# EAGLE design esp32_relay (EAGLE 7.4.0)
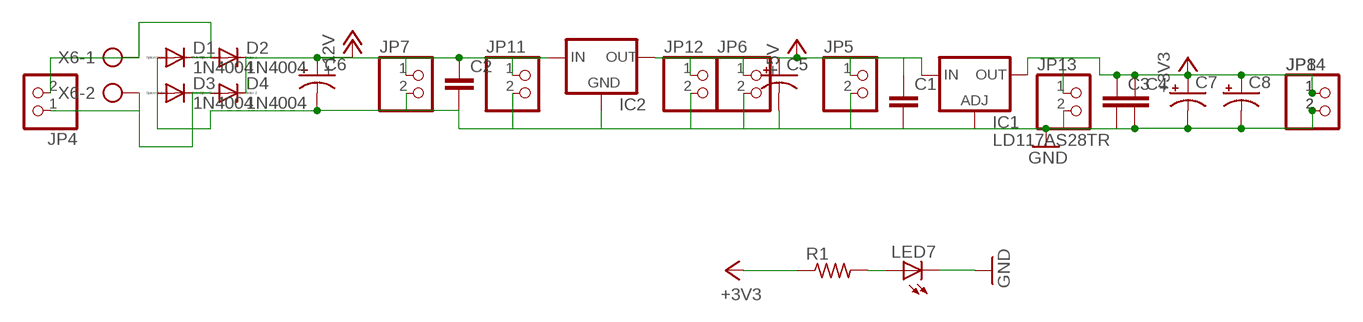
[diagram p0: schematic, sheet 1, part 1 of 2]
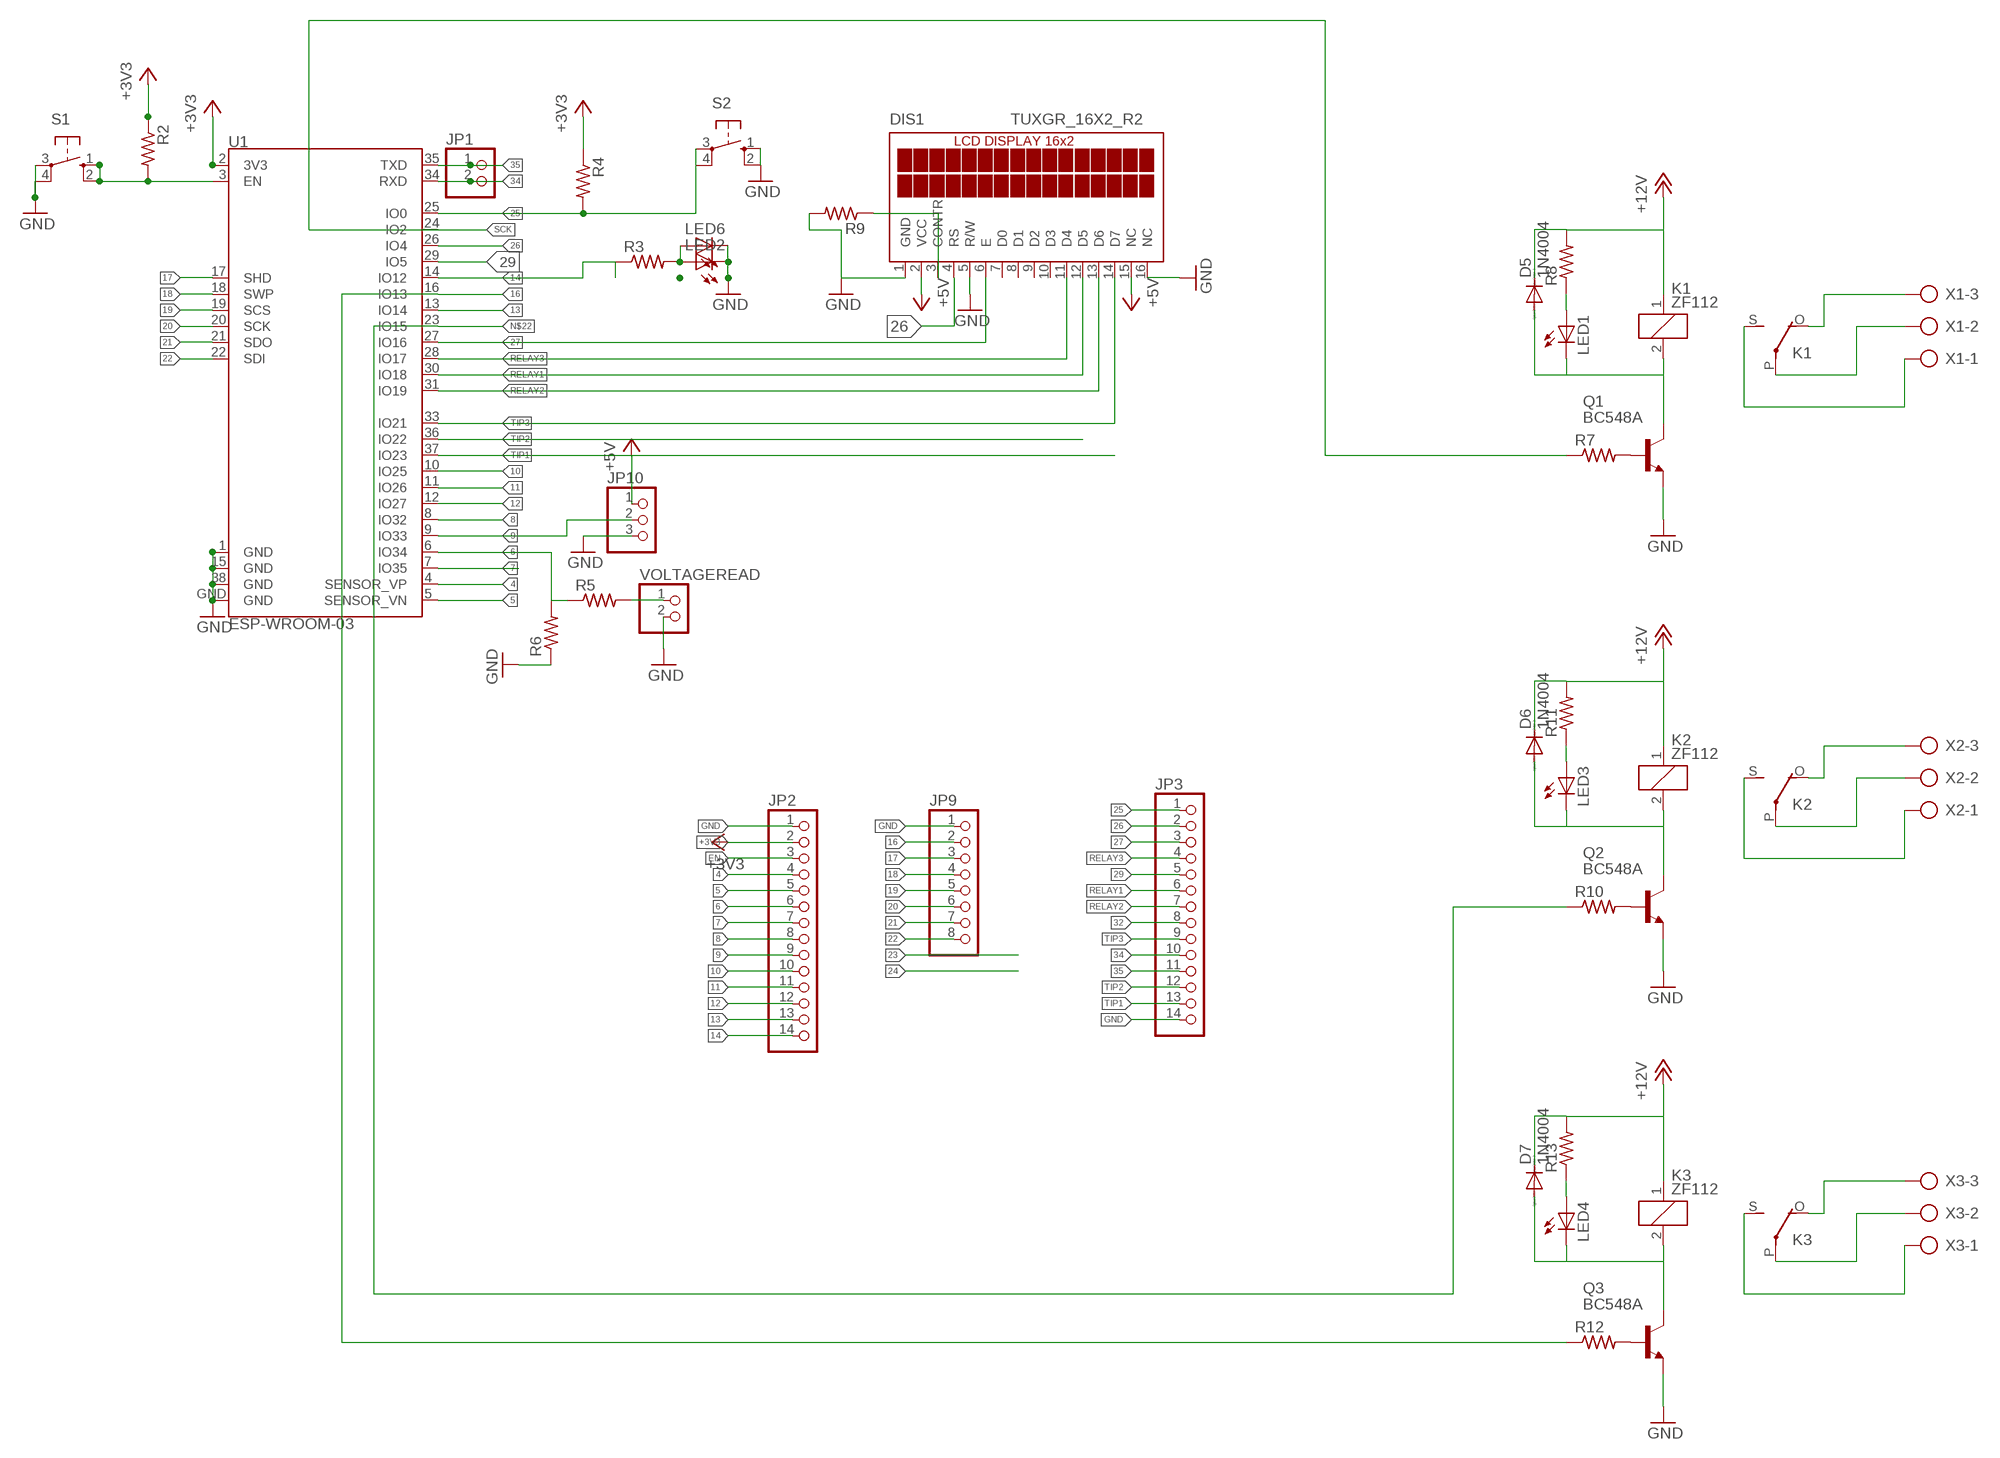
[diagram p1: schematic, sheet 1, part 2 of 2]

## Parts
C1  C-EUC1206  [C1206]
C2  C-EUC1206  [C1206]
C3  C-EUC1206  [C1206]
C4  C-EUC1206  [C1206]
C5  CPOL-USE2.5-7  [E2,5-7]
C6  CPOL-USE2.5-7  [E2,5-7]
C7  CPOL-USE2.5-6  [E2,5-6]
C8  CPOL-USE2.5-7  [E2,5-7]
D1  1N4004  [DO41-10]
D2  1N4004  [DO41-10]
D3  1N4004  [DO41-10]
D4  1N4004  [DO41-10]
D5  1N4004  [DO41-10]
D6  1N4004  [DO41-10]
D7  1N4004  [DO41-10]
DIS1  TUXGR_16X2_R2  [TUXGR_16X2_R2]
IC1  LD117AS28TR  [SOT223]
IC2  78XXL  [78XXL]
JP1  PINHD-1X2  [1X02]
JP2  PINHD-1X14  [1X14]
JP3  PINHD-1X14  [1X14]
JP4  PINHD-1X2  [1X02]
JP5  PINHD-1X2  [1X02]
JP6  PINHD-1X2  [1X02]
JP7  PINHD-1X2  [1X02]
JP8  PINHD-1X2  [1X02]
JP9  PINHD-1X8  [1X08]
JP10  PINHD-1X3  [1X03]
JP11  PINHD-1X2  [1X02]
JP12  PINHD-1X2  [1X02]
JP13  PINHD-1X2  [1X02]
JP14  PINHD-1X2  [1X02]
K1  ZF112  [ZF112]
K2  ZF112  [ZF112]
K3  ZF112  [ZF112]
LED1  LED3MM  [LED3MM]
LED2  LEDCHIPLED_1206  [CHIPLED_1206]
LED3  LED3MM  [LED3MM]
LED4  LED3MM  [LED3MM]
LED6  LED3MM  [LED3MM]
LED7  LED3MM  [LED3MM]
Q1  BC548A  [TO92-EBC]
Q2  BC548A  [TO92-EBC]
Q3  BC548A  [TO92-EBC]
R1  R-US_0207/7  [0207/7]
R2  R-US_0207/7  [0207/7]
R3  R-US_0207/7  [0207/7]
R4  R-US_0207/7  [0207/7]
R5  R-US_0207/7  [0207/7]
R6  R-US_0207/7  [0207/7]
R7  R-US_0207/7  [0207/7]
R8  R-US_0207/7  [0207/7]
R9  R-US_0207/7  [0207/7]
R10  R-US_0207/7  [0207/7]
R11  R-US_0207/7  [0207/7]
R12  R-US_0207/10  [0207/10]
R13  R-US_0207/7  [0207/7]
S1  10-XX  [B3F-10XX]
S2  10-XX  [B3F-10XX]
U1  ESP-WROOM-03  [ESP-WROOM-03]
VOLTAGEREAD  PINHD-1X2  [1X02]
X1  AK500/3-H  [AK500/3-H]
X2  AK500/3-H  [AK500/3-H]
X3  AK500/3-H  [AK500/3-H]
X6  AK500/2-H  [AK500/2-H]

## Nets
4: JP2.4 U1.4(SENSOR_VP)
5: JP2.5 U1.5(SENSOR_VN)
6: JP2.6 R5.1 R6.2 U1.6(IO34)
7: JP2.7 U1.7(IO35)
8: JP2.8 U1.8(IO32)
9: JP2.9 JP10.2 U1.9(IO33)
10: JP2.10 U1.10(IO25)
11: JP2.11 U1.11(IO26)
12: JP2.12 U1.12(IO27)
13: JP2.13 U1.13(IO14)
14: JP2.14 R3.1 U1.14(IO12)
16: JP9.2 R12.1 U1.16(IO13)
17: JP9.3 U1.17(SHD)
18: JP9.4 U1.18(SWP)
19: JP9.5 U1.19(SCS)
20: JP9.6 U1.20(SCK)
21: JP9.7 U1.21(SDO)
22: JP9.8 U1.22(SDI)
25: JP3.1 R4.2 S2.3(P) S2.4(P1) U1.25(IO0)
26: DIS1.4(RS) JP3.2 U1.26(IO4)
27: DIS1.6(E) JP3.3 U1.27(IO16)
29: JP3.5 U1.29(IO5)
32: JP3.8
34: JP1.2 JP3.10 U1.34(RXD)
35: JP1.1 JP3.11 U1.35(TXD)
+3V3: C3.1 C4.1 C7.+ C8.+ IC1.4(OUT) JP2.2 JP8.1 JP13.1 JP14.1 R1.1 R2.1 R4.1 U1.2(3V3)
+5V: C1.1 C5.+ DIS1.2(VCC) DIS1.15(NC) IC1.3(IN) IC2.OUT JP5.1 JP6.1 JP10.1 JP12.1
+12V: C2.1 C6.+ D2.C D4.C D5.C D6.C D7.C IC2.IN JP7.1 JP11.1 K1.1 K2.1 K3.1 R8.2 R11.2 R13.2
EN: JP2.3 R2.2 S1.1(S) S1.2(S1) U1.3(EN)
GND: C1.2 C2.2 C3.2 C4.2 C5.- C6.- C7.- C8.- D1.A D3.A DIS1.1(GND) DIS1.5(R/W) DIS1.16(NC) IC1.1(ADJ) IC2.GND JP2.1 JP3.14 JP5.2 JP6.2 JP7.2 JP8.2 JP9.1 JP10.3 JP11.2 JP12.2 JP13.2 JP14.2 LED2.C LED6.K(C) LED7.K(C) Q1.E Q2.E Q3.E R6.1 R9.2 S1.3(P) S1.4(P1) S2.1(S) S2.2(S1) U1.1(GND) U1.15(GND) U1.38(GND) U1.GND VOLTAGEREAD.2
N$3: LED7.A R1.2
N$5: D3.C D4.A JP4.1 X6.2
N$6: Q1.B R7.2
N$7: R5.2 VOLTAGEREAD.1
N$8: D5.A K1.2 LED1.K(C) Q1.C
N$9: K1.P(2:P) X1.2
N$10: LED2.A LED6.A R3.2
N$11: K1.O(2:O) X1.3
N$12: D1.C D2.A JP4.2 X6.1
N$13: K1.S(2:S) X1.1
N$14: LED1.A R8.1
N$16: DIS1.3(CONTR) R9.1
N$22: R10.1 U1.23(IO15)
N$24: Q2.B R10.2
N$25: D6.A K2.2 LED3.K(C) Q2.C
N$26: K2.P(2:P) X2.2
N$27: K2.O(2:O) X2.3
N$28: K2.S(2:S) X2.1
N$29: LED3.A R11.1
N$30: Q3.B R12.2
N$31: D7.A K3.2 LED4.K(C) Q3.C
N$32: K3.P(2:P) X3.2
N$33: K3.O(2:O) X3.3
N$34: K3.S(2:S) X3.1
N$35: LED4.A R13.1
RELAY1: DIS1.12(D5) JP3.6 U1.30(IO18)
RELAY2: DIS1.13(D6) JP3.7 U1.31(IO19)
RELAY3: DIS1.11(D4) JP3.4 U1.28(IO17)
SCK: R7.1 U1.24(IO2)
TIP1: JP3.13 U1.37(IO23)
TIP2: JP3.12 U1.36(IO22)
TIP3: DIS1.14(D7) JP3.9 U1.33(IO21)
Unconnected: DIS1.7(D0) DIS1.8(D1) DIS1.9(D2) DIS1.10(D3)

## Library data of the parts
C1-C4 = rcl:C-EU: CAPACITOR, European symbol
C5-C8 = rcl:CPOL-US: POLARIZED CAPACITOR, American symbol
D1-D7 = diode:1N4004: DIODE general purpose rectifier, 1 A
DIS1 = display-lcd:TUXGR_16X2_R2: Tuxgraphics LCD display 16x2 characters reflective, without background light Source: tuxgr_12x2_r2.pdf; OC_FARNELL: unknown; OC_NEWARK: unknown
IC1 = v-reg:LD117A?*: Low drop fixed and adjustable positive voltage regulators 1 A Source: http://www.st.com/stonline/products/literature/ds/7194/ld1117axx.pdf
IC2 = v-reg:78XXL: VOLTAGE REGULATOR
JP1 JP4-JP8 JP11-JP14 VOLTAGEREAD = pinhead:PINHD-1X2: PIN HEADER
JP2 JP3 = pinhead:PINHD-1X14: PIN HEADER
JP9 = pinhead:PINHD-1X8: PIN HEADER
JP10 = pinhead:PINHD-1X3: PIN HEADER
K1-K3 = relay:ZF112: RELAY 1 x switch; OC_FARNELL: unknown; OC_NEWARK: unknown
LED1-LED4 LED6 LED7 = led:LED: LED OSRAM: - CHIPLED LG R971, LG N971, LY N971, LG Q971, LY Q971, LO R971, LY R971 LH N974, LH R974 LS Q976, LO Q976, LY Q976 LO Q996 - Hyper CHIPLED LW Q18S LB Q993, LB Q99A, LB R99A - SideLED LS A670, LO A670, LY A670, LG A670, LP A670 LB A673, LV A673, LT A673, LW A673 LH A674 LY A675 LS A676, LA A676, LO A676, LY A676, LW A676 LS A679, LY A679, LG A679 - Hyper Micro SIDELED® LS Y876, LA Y876, LO Y876, LY Y876 LT Y87S - SmartLED LW L88C, LW L88S LB L89C, LB L89S, LG L890 LS L89K, LO L89K, LY L89K LS L896, LA L896, LO L896, LY L896 - TOPLED LS T670, LO T670, LY T670, LG T670, LP T670 LSG T670, LSP T670, LSY T670, LOP T670, LYG T670 LG T671, LOG T671, LSG T671 LB T673, LV T673, LT T673, LW T673 LH T674 LS T676, LA T676, LO T676, LY T676, LB T676, LH T676, LSB T676, LW T676 LB T67C, LV T67C, LT T67C, LS T67K, LO T67K, LY T67K, LW E67C LS E67B, LA E67B, LO E67B, LY E67B, LB E67C, LV E67C, LT E67C LW T67C LS T679, LY T679, LG T679 LS T770, LO T770, LY T770, LG T770, LP T770 LB T773, LV T773, LT T773, LW T773 LH T774 LS E675, LA E675, LY E675, LS T675 LS T776, LA T776, LO T776, LY T776, LB T776 LHGB T686 LT T68C, LB T68C - Hyper Mini TOPLED® LB M676 - Mini TOPLED Santana® LG M470 LS M47K, LO M47K, LY M47K Source: http://www.osram.convergy.de LUXEON: - LUMILED® LXK2-PW12-R00, LXK2-PW12-S00, LXK2-PW14-U00, LXK2-PW14-V00 LXK2-PM12-R00, LXK2-PM12-S00, LXK2-PM14-U00 LXK2-PE12-Q00, LXK2-PE12-R00, LXK2-PE12-S00, LXK2-PE14-T00, LXK2-PE14-U00 LXK2-PB12-K00, LXK2-PB12-L00, LXK2-PB12-M00, LXK2-PB14-N00, LXK2-PB14-P00, LXK2-PB14-Q00 LXK2-PR12-L00, LXK2-PR12-M00, LXK2-PR14-Q00, LXK2-PR14-R00 LXK2-PD12-Q00, LXK2-PD12-R00, LXK2-PD12-S00 LXK2-PH12-R00, LXK2-PH12-S00 LXK2-PL12-P00, LXK2-PL12-Q00, LXK2-PL12-R00 Source: www.luxeon.com KINGBRIGHT: KA-3528ASYC Source: www.kingbright.com
Q1-Q3 = transistor-npn:BC548*: NPN Transistor
R1-R13 = rcl:R-US_: RESISTOR, American symbol
S1 S2 = switch-omron:10-XX: OMRON SWITCH; MPN: B3F-1000; OC_FARNELL: 176432; OC_NEWARK: 36M3542
U1 = esp32:ESP-WROOM-03
X1-X3 = con-ptr500:AK500/3-H: CONNECTOR Aug. 2004 / PTR Meßtechnik: Die Bezeichnung der Serie AK505 wurde geändert. Es handelt sich hierbei um AK500 in horizontaler Ausführung.; OC_FARNELL: unknown; OC_NEWARK: unknown
X6 = con-ptr500:AK500/2-H: CONNECTOR Aug. 2004 / PTR Meßtechnik: Die Bezeichnung der Serie AK505 wurde geändert. Es handelt sich hierbei um AK500 in horizontaler Ausführung.; OC_FARNELL: unknown; OC_NEWARK: unknown

## Board
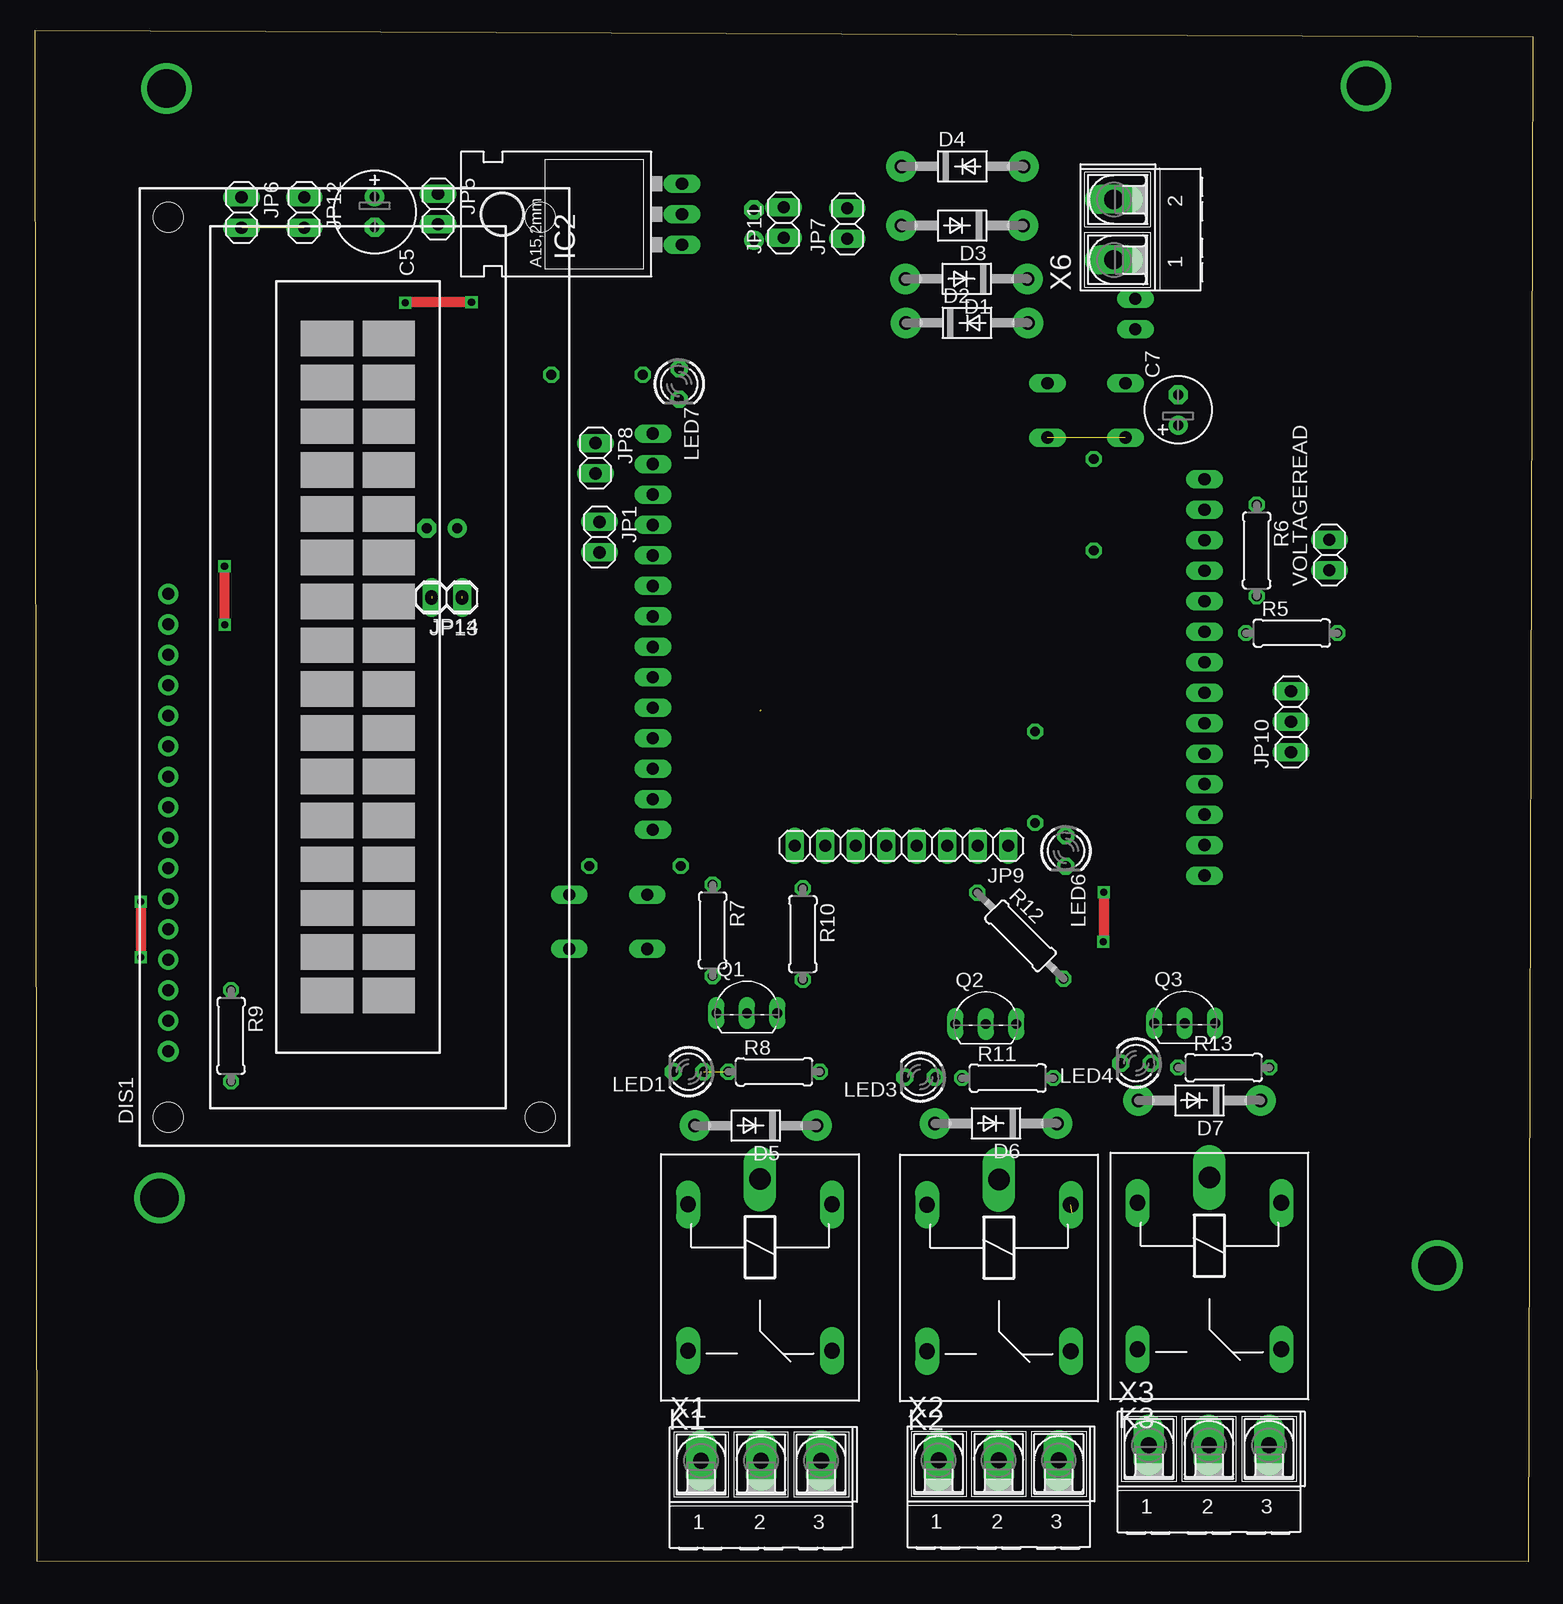
[diagram p2: board, top side]
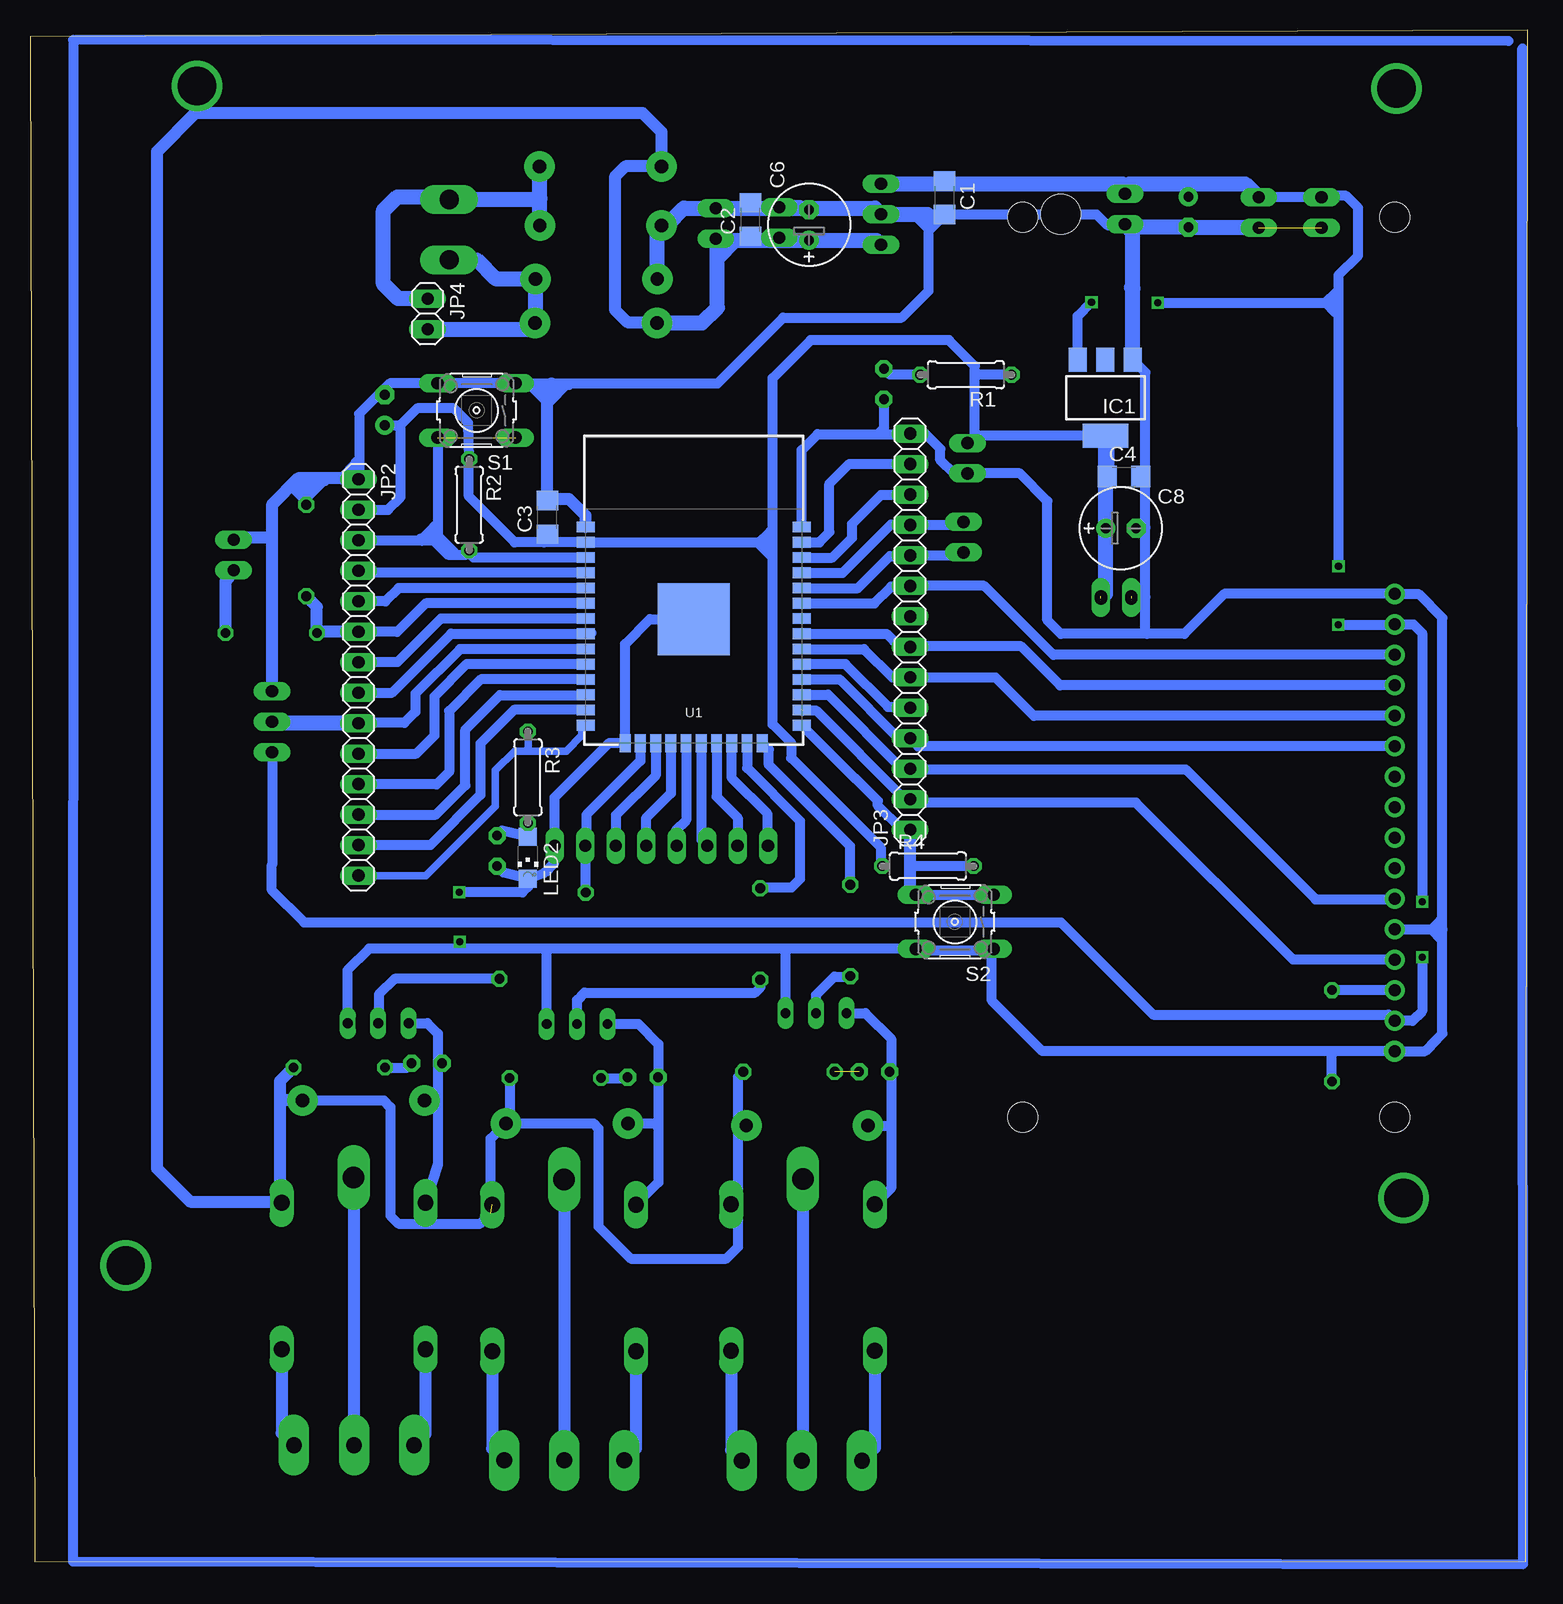
[diagram p3: board, bottom side, seen from below]

Size 124.82 x 127.66 mm. Coordinates in mm from the lower left corner, seen from the top.
Outline: 124.43,0 0.18,0.08 0,127.66 124.82,127.09 124.43,0
Copper layers (1*16): Top 0.035mm / dielectric 1.5mm / Bottom 0.035mm
Design rules "default": minimum track width 10mil, minimum drill 24mil, track to track 8mil, track to pad 8mil, pad to pad 8mil, via to via 8mil, smd to smd 8mil, copper to edge 40mil, drill to drill 8mil, minimum pad ring 10mil, minimum via ring 8mil, stop-mask expansion 4mil, vias tented up to drill 0mil, thermal gap 10mil
bRestrict: area 60.2,87.7 to 78.8,94

### Footprints (pad centres in the part's own frame; a part is rotated, then mirrored left to right if it is on the bottom)
C1206 = smd 1.6 x 1.8: 1 -1.4,0; 2 1.4,0
E2,5-7 = drill 0.813 pad 1.6: + -1.27,0 | drill 0.813 pad 1.6 octagon: - 1.27,0
E2,5-6 = drill 0.813 pad 1.6: + -1.27,0 | drill 0.813 pad 1.6 octagon: - 1.27,0
DO41-10 = drill 1.118 pad 2.54: A 5.08,0; C -5.08,0
TUXGR_16X2_R2 = drill 1 pad 1.778: 1 -32,15.5 | drill 1 pad 1.676: 2 -29.46,15.5; 3 -26.92,15.5; 4 -24.38,15.5; 5 -21.84,15.5; 6 -19.3,15.5; 7 -16.76,15.5; 8 -14.22,15.5; 9 -11.68,15.5; 10 -9.14,15.5; 11 -6.6,15.5; 12 -4.06,15.5; 13 -1.52,15.5; 14 1.02,15.5; 15 3.56,15.5; 16 6.1,15.5 | hole 2.5: -37.5,-15.5; 37.5,-15.5; -37.5,15.5; 37.5,15.5
SOT223 = smd 1.5 x 2: 1 -2.3,-3.15; 2 0,-3.15; 3 2.3,-3.15 | smd 3.8 x 2: 4 0,3.15
78XXL = drill 1.016 long: GND 0,-3.81; IN -2.54,-3.81; OUT 2.54,-3.81 | hole 3.302: 0,11.176
1X02 = drill 1.016 long: 1 -1.27,0; 2 1.27,0
1X14 = drill 1.016 long: 1 -16.51,0; 2 -13.97,0; 3 -11.43,0; 4 -8.89,0; 5 -6.35,0; 6 -3.81,0; 7 -1.27,0; 8 1.27,0; 9 3.81,0; 10 6.35,0; 11 8.89,0; 12 11.43,0; 13 13.97,0; 14 16.51,0
1X08 = drill 1.016 long: 1 -8.89,0; 2 -6.35,0; 3 -3.81,0; 4 -1.27,0; 5 1.27,0; 6 3.81,0; 7 6.35,0; 8 8.89,0
1X03 = drill 1.016 long: 1 -2.54,0; 2 0,0; 3 2.54,0
ZF112 = drill 1.321 long: 1 -6.096,5.994; 2 -6.096,-5.994; O 6.096,5.994; S 6.096,-5.994 | drill 1.803 long: P -8.204,0
LED3MM = drill 0.813 pad 1.422 octagon: A -1.27,0; K 1.27,0
CHIPLED_1206 = smd 1.5 x 1.5: A 0,-1.75; C 0,1.75
TO92-EBC = drill 0.813 long: B 0,-1.27; C -2.54,-1.27; E 2.54,-1.27
0207/7 = drill 0.813 octagon: 1 -3.81,0; 2 3.81,0
0207/10 = drill 0.813 octagon: 1 -5.08,0; 2 5.08,0
B3F-10XX = drill 1.016 long: 1 -3.251,2.261; 2 3.251,2.261; 3 -3.251,-2.261; 4 3.251,-2.261
ESP-WROOM-03 = smd 0.9 x 1.5: 1 7.7,9; 2 6.43,9; 3 5.16,9; 4 3.89,9; 5 2.62,9; 6 1.35,9; 7 0.08,9; 8 -1.19,9; 9 -2.46,9; 10 -3.73,9; 11 -5,9; 12 -6.27,9; 13 -7.54,9; 14 -8.81,9; 25 -8.81,-9; 26 -7.54,-9; 27 -6.27,-9; 28 -5,-9; 29 -3.73,-9; 30 -2.46,-9; 31 -1.19,-9; 32 0.08,-9; 33 1.35,-9; 34 2.62,-9; 35 3.89,-9; 36 5.16,-9; 37 6.43,-9; 38 7.7,-9 | smd 1.5 x 0.9: 15 -10.3,5.715; 16 -10.3,4.445; 17 -10.3,3.175; 18 -10.3,1.905; 19 -10.3,0.635; 20 -10.3,-0.635; 21 -10.3,-1.905; 22 -10.3,-3.175; 23 -10.3,-4.445; 24 -10.3,-5.715 | smd 6 x 6: GND 0,0
AK500/3-H = drill 1.321 pad 2.54 long: 1 -5.004,0; 2 0,0; 3 5.004,0
AK500/2-H = drill 1.6 long: 1 -2.515,0; 2 2.515,0

### Placement (x,y rotation side)
C1  48.62,113.68 270 bottom
C2  64.78,111.87 90 bottom
C3  81.7,87.05 90 bottom
C4  33.65,90.44 0 bottom
C5  28.29,112.5 270 top
C6  59.9,111.42 90 bottom
C7  95.26,96 90 top
C8  33.91,86.14 0 bottom
D1  77.63,106.92 180 top
D2  77.67,103.25 0 top
D3  77.26,111.37 180 top
D4  77.27,116.29 0 top
D5  60.05,36.36 180 top
D6  80.08,36.54 180 top
D7  97.03,38.46 180 top
DIS1  26.6,74.56 90 top
IC1  35.21,97.02 180 bottom
IC2  50.09,112.31 90 top
JP1  47.03,85.39 270 top
JP2  97.45,73.71 270 bottom
JP3  51.48,77.52 90 bottom
JP4  91.69,104 270 bottom
JP5  33.57,112.74 270 top
JP6  17.2,112.45 270 top
JP7  67.68,111.53 90 top
JP8  46.7,91.97 270 top
JP9  72.2,59.68 180 top
JP10  104.65,70.02 90 top
JP11  62.38,111.61 90 top
JP12  22.42,112.45 270 top
JP13  34.31,80.29 180 top
JP14  34.31,80.45 180 top
K1  60.41,23.7 270 top
K2  80.32,23.66 270 top
K3  97.86,23.83 270 top
LED1  54.46,40.84 180 top
LED2  83.33,58.7 180 bottom
LED3  73.75,40.4 180 top
LED4  91.75,41.55 180 top
LED6  85.9,59.26 270 top
LED7  53.66,98.16 270 top
Q1  59.31,47 0 top
Q2  79.23,46.1 0 top
Q3  95.8,46.16 0 top
R1  46.83,98.93 180 bottom
R2  88.22,88.1 270 bottom
R3  83.33,65.39 270 bottom
R4  49.99,57.99 0 bottom
R5  104.72,77.41 0 top
R6  101.8,84.29 270 top
R7  56.46,52.63 270 top
R8  61.57,40.84 0 top
R9  16.32,43.84 270 top
R10  63.98,52.32 270 top
R11  81.04,40.32 0 top
R12  82.11,52.18 315 top
R13  99.05,41.2 0 top
S1  87.61,95.96 180 bottom
S2  47.76,53.34 180 bottom
U1  69.51,78.54 90 bottom
VOLTAGEREAD  107.85,83.92 90 top
X1  60.5,8.43 0 top
X2  80.29,8.47 0 top
X3  97.82,9.73 0 top
X6  89.9,111.02 90 top

### Tracks (layer width: path | path; a pad name or v marks a point on that pad's centre or on a via)
4
  Bottom 0.813: U1.4 97.28,82.43 JP2.4
5
  Bottom 0.813: U1.5 94.1,81.16 95.2,80.05 97.44,80.05 JP2.5
6
  Bottom 0.813: U1.6 91.85,79.89 94.23,77.51 97.44,77.51 JP2.6
  Bottom 1.016: JP2.6 100.79,77.52 R5.1 100.91,79.59 R6.2
7
  Bottom 0.813: U1.7 90.58,78.62 94.2,74.99 97.44,74.99 JP2.7
8
  Bottom 0.813: JP2.8 94.65,72.44 89.73,77.36 78.31,77.36 | 78.31,77.36 78.07,77.36 78.01,77.42 | U1.8 78.32,77.35 78.31,77.36
9
  Bottom 0.813: U1.9 88.98,76.08 92.7,72.35 92.7,70.84 93.62,69.93 97.43,69.93 JP2.9
  Bottom 1.27: JP2.9 104.54,69.9 JP10.2
10
  Bottom 0.813: JP2.10 92.63,67.36 91.1,68.89 91.1,72.14 88.41,74.83 78.53,74.83 U1.10
11
  Bottom 0.813: U1.11 87.25,73.54 89.9,70.89 89.9,65.84 90.94,64.8 97.43,64.8 JP2.11
12
  Bottom 0.813: JP2.12 90.99,62.28 88.55,64.72 88.55,69.36 85.67,72.24 78.54,72.24 U1.12
13
  Bottom 0.813: U1.13 84.48,71 87.28,68.2 87.28,63.92 91.46,59.74 JP2.13
14
  Bottom 0.61: JP2.14 91.83,57.2 86.04,62.99 86.04,65.96 84.42,67.58 83.57,67.58 | 83.57,67.58 83.3,67.58 | 83.3,67.58 80.13,67.58 78.82,68.89 78.82,69.42 U1.14 | 83.53,67.62 83.57,67.58 | R3.1 83.3,69.2 83.3,67.58
16
  Bottom 0.813: U1.16 73.96,66.75 78.45,62.26 78.45,60.48 78.63,60.3 78.63,59.75 JP9.2 78.55,55.81 R12.1
17
  Bottom 0.813: U1.17 72.69,65.53 75.99,62.23 75.99,59.7 JP9.3
18
  Bottom 0.813: U1.18 71.42,64.05 73.5,61.96 73.5,59.7 JP9.4
19
  Bottom 0.813: U1.19 70.15,61.82 71,60.97 71,59.74 JP9.5
20
  Bottom 0.813: U1.20 68.88,60.16 JP9.6
21
  Bottom 0.813: U1.21 67.61,63.77 65.84,62 65.84,59.69 JP9.7
22
  Bottom 0.813: JP9.8 63.4,59.77 63.4,62.38 66.34,65.32 U1.22
  Bottom 1.016: 63.3,59.66 JP9.8
25
  Bottom 0.813: S2.4 S2.3 | U1.25 56.09,65.3 56.05,65.3 54.17,63.42 54.17,63.03 52.19,61.05 51.52,61.05 JP3.1 | R4.2 51.48,57.99 51.48,58.14
  Bottom 1.016: S2.4 51.48,55.6 51.48,58.14 JP3.1
26  (1 unrouted)
  Bottom 0.813: JP3.2 51.91,63.55 | 51.91,63.55 51.97,63.61 59.28,70.92 60.43,70.92 | DIS1.4 19.57,50.18 32.67,63.28 51.64,63.28 51.91,63.55
27
  Bottom 0.813: U1.27 58.31,72.27 52.16,66.12 51.05,66.12 50.97,66.04 | 50.97,66.04 51.43,66.04 JP3.3 | 50.97,66.04 28.52,66.04 17.68,55.21 11.15,55.21 DIS1.6
29
  Bottom 0.813: JP3.5 51.55,71.25 53.32,71.25 56.88,74.81 U1.29
34
  Bottom 0.813: U1.34 55.83,81.16 53.17,83.82 51.53,83.82 JP3.10 47.29,83.87 JP1.2
35
  Bottom 0.813: U1.35 57.1,82.43 53.09,86.44 51.5,86.44 JP3.11 47.29,86.41 JP1.1
+3V3  (1 unrouted)
  Bottom 0.813: JP2.2 94.99,87.68 93.93,88.74 93.93,94.76 | 93.93,94.76 92.56,96.13 89.51,96.13 88.31,94.92 R2.1 88.24,91.88 88.24,88.79 84.43,84.97 81.98,84.97 | 81.98,84.97 U1.2 78.47,84.93 62.98,84.93 62.93,84.98 | C3.1 81.7,85.25 81.98,84.97 | 62.93,84.98 62.93,69.8 61.4,68.26 61.4,67.01 53.93,59.54 53.93,58.12 R4.1 | 62.93,84.98 62.93,98.64 59.76,101.82 48.24,101.82 46.08,99.66 46.08,99.11 | 43.03,98.95 R1.1 45.9,98.93 46.08,99.11 | IC1.4 46.08,93.87 | 46.08,93.87 JP8.1 | 46.08,93.87 46.08,99.11 | C7.+ 93.96,94.73 93.93,94.76
  Bottom 1.27: 35.21,86.35 IC1.4 35.05,93.7 C4.1 | 35.21,86.35 35.21,80.66 JP13.1 | C8.+ 35.18,86.32 35.21,86.35
+5V  (via drill 0.6 pad 0.81, 0.6 pad 1.02)
  Top 0.813: v15.78,82.97 15.78,78.12 v15.79,78.11 | v8.81,55 v8.81,50.38 | v36.37,104.97 30.89,104.97 v30.85,104.93
  Bottom 0.813: JP12.1 JP6.1 17.07,113.84 15.14,113.84 14.14,112.84 14.14,108.86 15.79,107.21 15.79,104.62 | 15.79,104.62 15.79,82.98 v15.78,82.97 | v15.79,78.11 11.12,78.11 DIS1.15 9.53,78.12 8.81,77.39 v8.81,55 | v8.81,50.38 8.81,45.91 9.63,45.09 11.08,45.09 DIS1.2 11.62,45.62 31.22,45.62 38.91,53.3 101.99,53.3 104.67,55.98 104.67,58.09 104.65,58.1 JP10.1 | C1.1 48.87,115.08 49.1,114.85 | IC1.3 37.51,103.82 v36.37,104.97 | v30.85,104.93 16.1,104.93 15.79,104.62
  Bottom 1.27: IC2.OUT 49.1,114.85 33.8,114.85 33.5,114.55 | 28.24,114.85 33.2,114.85 33.5,114.55 | 28.24,114.85 23.55,114.85 JP12.1 | C5.+ 28.29,114.8 28.24,114.85 | JP5.1 33.57,114.48 33.5,114.55
+12V  (1 unrouted)
  Bottom 0.813: 65.4,110.12 65.75,110.12 67.56,108.32 | D7.C 95.33,38.46 94.79,37.91 94.79,28.85 94.13,28.19 87.31,28.19 86.43,29.07 86.43,35.27 D6.C | D6.C 77.86,36.54 77.45,36.13 77.45,27.97 74.76,25.27 66.79,25.27 65.8,26.26 65.8,29.62 | 65.8,29.62 65.8,36.45 | 65.8,36.45 65.8,40.42 R8.2 | D5.C 65.72,36.36 65.8,36.45 | K1.1 66.86,29.79 66.87,29.81 65.99,29.81 65.8,29.62 | R11.2 84.85,36.84 D6.C
  Bottom 1.016: D2.C 72.65,103.31 75.04,103.31 76.09,104.37 76.09,115.42 75.21,116.29 D4.C 72.2,116.31 72.2,119.18 73.78,120.75 111,120.75 114.23,117.53 114.23,32.78 111.49,30.04 103.97,30.04 | 103.97,30.04 K3.1 | 103.97,30.04 103.97,38.6 | 103.97,38.6 103.97,40.09 R13.2 | D7.C 103.83,38.46 103.97,38.6
  Bottom 1.27: D2.C 68.83,103.25 67.54,104.53 67.54,110.12 | 67.54,110.12 JP7.1 | 67.54,110.12 65.4,110.12 64.89,110.12 | 64.89,110.12 62.06,110.12 | 62.06,110.12 60.05,110.12 | 60.05,110.12 54.26,110.12 IC2.IN | C6.+ 60.03,110.15 60.05,110.12 | C2.1 64.78,110.24 64.89,110.12 | JP11.1 62.27,110.34 62.06,110.12
EN  (1 unrouted)
  Bottom 0.813: U1.3 87.88,83.7 R2.2 88.48,83.95 90.01,83.95 91.2,85.14 | JP2.3 91.2,85.14 | S1.2 90.86,85.48 91.2,85.14
GND  (via drill 0.6)  (2 unrouted)
  Top 0.813: v89.04,55.82 89.04,51.71 v89.01,51.68
  Bottom 0.406: 60.56,86.28 U1.38
  Bottom 0.813: 69.46,78.49 U1.GND 69.54,78.56 73.16,78.56 75.23,76.49 U1.15 75.25,68.26 76.54,68.26 81.09,63.7 JP9.1 81.17,59.6 81.17,58.22 81.94,57.45 LED2.C | 68.64,78.56 68.61,78.54 | LED2.C 85.35,57.45 LED6.K | 95.26,97.8 94.84,98.22 S1.4 S1.3 81.36,98.22 67.52,98.22 62.06,103.68 52.18,103.68 49.94,105.92 49.94,112.22 | 95.26,97.8 97.39,95.67 97.39,90.28 JP2.1 | 49.94,112.22 50.03,112.31 35.96,112.31 35.04,111.39 33.65,111.39 JP5.2 | U1.38 60.51,92.66 59.19,93.98 54.16,93.98 | 54.16,93.98 51.53,93.98 JP3.14 | LED7.K 53.66,94.48 54.16,93.98 | 51.28,93.83 JP3.14 | 7.12,52.71 7.12,44.02 7.61,43.52 7.61,43.51 8.56,42.56 DIS1.1 16.64,42.56 | 7.12,52.71 7.12,78.68 9.06,80.62 11.06,80.62 DIS1.16 25.3,80.66 28.62,77.34 31.73,77.34 | DIS1.5 7.13,52.72 7.12,52.71 | 31.73,77.34 38.91,77.34 40.04,78.47 40.04,88.41 42.33,90.7 JP8.2 47.85,90.7 48.95,91.81 48.95,92.76 50.26,94.07 51.44,94.07 JP3.14 | 31.73,77.34 31.87,77.48 31.87,80.42 | 31.87,80.42 31.87,86.21 | 31.87,86.21 31.87,90.32 | 31.87,90.32 31.87,99.13 IC1.1 | C4.2 31.98,90.44 31.87,90.32 | C8.- 31.93,86.14 31.87,86.21 | JP13.2 32,80.29 31.87,80.42 | 16.64,42.56 40.45,42.56 44.66,46.77 44.66,50.93 | 44.66,50.93 S2.1 | 44.66,50.93 50.86,50.93 S2.2 51.05,51.12 61.61,51.12 | R9.2 16.32,42.24 16.64,42.56 | 49.94,112.22 48.68,112.22 C1.2 | C7.- 95.26,97.8 | Q1.E 61.85,50.88 61.61,51.12 | 61.61,51.12 82.01,51.12 | 82.01,51.12 89.04,51.12 | 89.04,51.12 96.56,51.12 98.38,49.3 98.38,44.93 Q3.E | Q2.E 81.77,50.88 82.01,51.12 | LED2.C 83.33,56.26 83.8,55.79 89.02,55.79 v89.04,55.82 | v89.01,51.68 89.01,51.16 89.04,51.12
  Bottom 1.016: JP10.3 104.65,85.43 | 104.65,85.43 104.65,88.09 102.41,90.34 101.54,90.34 | VOLTAGEREAD.2 107.37,85.4 104.69,85.4 104.65,85.43 | 101.54,90.34 97.57,90.34 JP2.1 | R6.1 101.8,90.08 101.54,90.34 | U1.1 78.51,87.19 79.89,88.57 81.58,88.57 C3.2 81.7,97.88 81.36,98.22 | 68.64,78.56 68.33,78.87 69.18,78.87 U1.GND
  Bottom 1.27: 67.54,112.81 70.33,112.81 71.77,111.37 D3.A 72.55,111 D1.A | 67.54,112.81 65.12,112.81 | 65.12,112.81 60.65,112.81 | 60.65,112.81 60.15,112.81 | 60.15,112.81 54.41,112.81 IC2.GND 50.03,112.31 | C6.- 60.03,112.69 60.15,112.81 | C2.2 64.78,113.16 65.12,112.81 | JP7.2 67.56,112.8 67.54,112.81 | JP11.2 60.71,112.88 60.65,112.81 | 48.65,112.31 C1.2 | JP12.2 28.24,111.18 C5.- 33.33,111.23 JP5.2 32.91,110.81 32.91,106.12 | IC1.1 32.91,106.12 | 33.01,106.22 32.91,106.12
N$2  (via drill 3.2 pad 3.2)
  other vias: 10.95,122.78
N$3
  Bottom 0.813: R1.2 53.17,98.93 LED7.A
N$5
  Bottom 1.27: JP4.1 94.14,105.27 95.37,106.5 95.37,112.6 94.21,113.75 90.11,113.75 X6.2 82.4,113.54 82.34,113.6 | D3.C 82.34,113.6 | 82.34,113.6 82.34,116.28 D4.A
N$6
  Bottom 0.813: Q1.B 59.31,47.26 57.79,48.78 56.49,48.78 R7.2
N$7
  Bottom 1.016: R5.2 108.53,81.7 VOLTAGEREAD.1
N$8
  Bottom 0.813: Q1.C 55.2,45.73 53.05,43.59 53.05,40.28 | 53.05,40.28 53.05,36.13 | 53.05,36.13 53.05,31.15 K1.2 | D5.A 53.28,36.36 53.05,36.13 | LED1.K 53.19,40.42 53.05,40.28
N$9
  Bottom 1.016: K1.P 60.41,8.52 X1.2
N$10
  Bottom 0.813: R3.2 83.48,61.08 LED2.A 85.48,60.95 LED6.A
N$11
  Bottom 1.016: K1.O 66.4,9.33 X1.3
N$12
  Bottom 1.27: X6.1 87.61,108.51 86.05,106.95 82.73,106.95 D1.C 82.71,103.29 D2.A 83.27,102.73 JP4.2
N$13
  Bottom 1.016: K1.S 54.41,9.51 X1.1
N$14  (1 unrouted)
N$15
  Bottom 0.813: 15.89,104.06 16.01,104.06 16.86,104.92 16.85,104.92 15.98,105.78
N$16
  Bottom 0.813: DIS1.3 R9.1
N$17
  Bottom 0.813: 7.16,51.8 7.16,51.82 8.02,52.68 8.02,52.73 7.27,53.48
N$18
  Bottom 0.813: 79.9,98.08 80.14,98.08 81.53,96.7 81.77,96.7 82.97,97.9 81.42,97.9 81.21,97.69
N$19
  Bottom 0.813: 100.23,90.09 100.34,90.09 101.81,88.62 102.06,88.62 102.9,89.46 102.28,89.46 102.14,89.6 101.45,89.6 101.31,89.74
N$20
  Bottom 0.813: 48.71,112.23 48.71,112.15 49.81,111.05 49.92,111.05 50.92,112.05
N$21
  Bottom 0.813: 63.06,83.81 63.06,83.82 64.13,84.89 63.11,85.9
N$22
  Bottom 0.813: U1.23 65.07,66.17 60.66,61.76 60.66,56.91 61.37,56.2 63.91,56.2 R10.1
N$24
  Bottom 0.813: Q2.B 79.23,46.83 78.62,47.43 64.39,47.43 63.94,47.89 63.94,48.48 R10.2
N$25
  Bottom 0.813: Q2.C 74.12,44.83 72.45,43.15 72.45,40.51 | 72.45,40.51 72.45,36.23 | 72.45,36.23 72.45,31.64 K2.2 | D6.A 72.75,36.54 72.45,36.23 | LED3.K 72.48,40.48 72.45,40.51
N$26
  Bottom 1.016: K2.P 80.32,8.5 X2.2
N$27
  Bottom 1.016: K2.O 86.31,9.46 84.89,8.04 84.89,8.06 X2.3
N$28
  Bottom 1.016: K2.S 74.33,9.44 X2.1
N$29
  Bottom 0.813: R11.1 75.1,40.32 LED3.A
N$30
  Bottom 0.813: R12.2 94.44,48.59 95.74,47.3 95.74,44.96 Q3.B
N$31
  Bottom 0.813: Q3.C 91.7,44.89 90.84,44.03 90.84,41.52 | 90.84,41.52 90.84,38.37 | 90.84,38.37 90.84,33.16 K3.2 | D7.A 90.92,38.46 90.84,38.37 | LED4.K 90.8,41.55 90.84,41.52
N$32
  Bottom 1.016: K3.P 97.86,9.42 98.13,9.16 97.78,9.16 97.31,9.63 97.36,9.63 98.01,8.98 98.01,9.54 X3.2
N$33
  Bottom 1.016: K3.O 103.85,10.76 X3.3
N$34
  Bottom 1.016: K3.S 91.86,10.68 X3.1
N$35
  Bottom 0.813: R13.1 93.38,41.2 LED4.A
N$46  (via drill 3.2 pad 3.2)
  other vias: 110.91,123
N$51  (via drill 3.2 pad 3.2)
  other vias: 116.85,24.7
N$52  (via drill 3.2 pad 3.2)
  other vias: 10.36,30.33
N$82
  Bottom 1.016: 92.23,85.19 92.09,85.19 91.05,86.23 91.05,85.6 89.63,84.18
N$83
  Bottom 1.016: 97.59,91.58 97.59,91.5 98.81,90.28
N$89
  Bottom 0.813: 50.22,55.63 50.22,55.75
N$90
  Bottom 0.813: 1.63,126.73 121.23,126.84 121.25,0.04 0.39,-0.19 0.46,126.12
RELAY1
  Bottom 0.813: U1.30 55.33,76.08 52.96,73.71 JP3.6 51.45,73.69 44.35,73.69 41.17,70.5 DIS1.12
RELAY2
  Bottom 0.813: U1.31 53.43,77.35 52.41,76.33 52.1,76.33 | 52.1,76.33 51.55,76.33 JP3.7 | DIS1.13 38.97,73.04 42.22,76.29 52.06,76.29 52.1,76.33
RELAY3
  Bottom 0.813: U1.28 57.35,73.54 52.41,68.59 51.52,68.59 JP3.4 50.81,67.96 DIS1.11
SCK
  Bottom 0.813: 63.81,68.22 U1.24 63.25,67.69 63.25,66.42 56.48,59.65 R7.1
TIP1
  Bottom 0.813: U1.37 59.04,84.97 58.2,85.81 58.2,89.85 56.55,91.5 51.49,91.5 JP3.13
TIP2
  Bottom 0.813: U1.36 57.96,83.7 56.32,85.34 56.32,86.5 53.89,88.93 51.5,88.93 JP3.12
TIP3
  Bottom 0.813: U1.33 54.45,79.89 53.07,81.27 51.54,81.27 JP3.9 51.47,81.34 45.31,81.34 39.54,75.58 DIS1.14